# Altium schematic sheet Top Level.SchDoc
size A
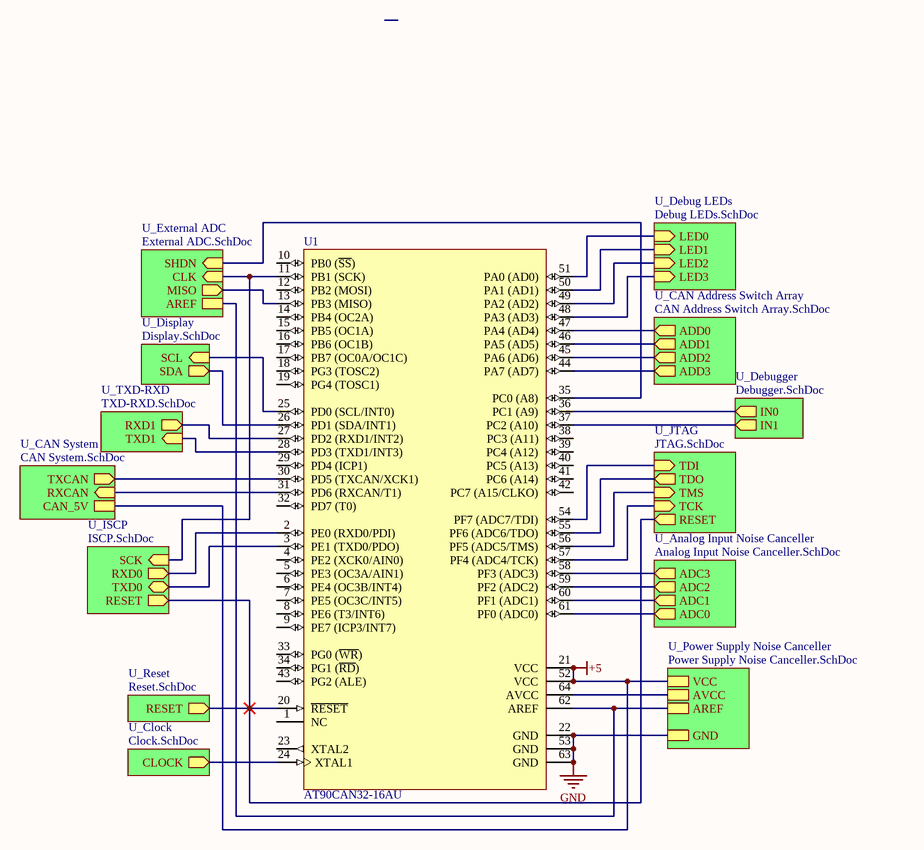
[diagram p0: Top Level.SchDoc]

## Parts
U1  AT90CAN32-16AU  [64A_N]

## Sub-sheets
U_Analog Input Noise Canceller = Analog Input Noise Canceller.SchDoc: ADC0 (out), ADC1 (out), ADC2 (out), ADC3 (out)
U_CAN Address Switch Array = CAN Address Switch Array.SchDoc: ADD0 (out), ADD1 (out), ADD2 (out), ADD3 (out)
U_CAN System = CAN System.SchDoc: RXCAN (in), CAN_5V, TXCAN (out)
U_Clock = Clock.SchDoc: CLOCK (out)
U_Debug LEDs = Debug LEDs.SchDoc: LED0 (in), LED1 (in), LED2 (in), LED3 (in)
U_Debugger = Debugger.SchDoc: IN0 (out), IN1 (out)
U_Display = Display.SchDoc: SCL (in), SDA (out)
U_External ADC = External ADC.SchDoc: AREF, CLK (in), SHDN (in), MISO (out)
U_ISCP = ISCP.SchDoc: SCK (in), TXD0 (bidir), RESET (out), RXD0 (out)
U_JTAG = JTAG.SchDoc: TDI (in), TDO (out), TCK (in), TMS (in), RESET (out)
U_Power Supply Noise Canceller = Power Supply Noise Canceller.SchDoc: VCC, AREF, GND, AVCC
U_Reset = Reset.SchDoc: RESET (out)
U_TXD-RXD = TXD-RXD.SchDoc: TXD1 (in), RXD1 (out)

## Nets
+5: U1.21(VCC) U1.52(VCC) ; sheet U_Power Supply Noise Canceller/VCC, sheet U_CAN System/CAN_5V
GND: U1.22(GND) U1.53(GND) U1.63(GND) ; sheet U_Power Supply Noise Canceller/GND
NetU1_2: U1.2(PE0_(RXD0/PDI)) ; sheet U_ISCP/RXD0
NetU1_3: U1.3(PE1_(TXD0/PDO)) ; sheet U_ISCP/TXD0
NetU1_11: U1.11(PB1_(SCK)) ; sheet U_ISCP/SCK, sheet U_External ADC/CLK
NetU1_13: U1.13(PB3_(MISO)) ; sheet U_External ADC/MISO
NetU1_20: U1.20(~{RESET}) ; sheet U_JTAG/RESET, sheet U_Reset/RESET, sheet U_ISCP/RESET
NetU1_24: U1.24(XTAL1) ; sheet U_Clock/CLOCK
NetU1_25: U1.25(PD0_(SCL/INT0)) ; sheet U_Display/SCL
NetU1_26: U1.26(PD1_(SDA/INT1)) ; sheet U_Display/SDA
NetU1_27: U1.27(PD2_(RXD1/INT2)) ; sheet U_TXD-RXD/RXD1
NetU1_28: U1.28(PD3_(TXD1/INT3)) ; sheet U_TXD-RXD/TXD1
NetU1_30: U1.30(PD5_(TXCAN/XCK1)) ; sheet U_CAN System/TXCAN
NetU1_31: U1.31(PD6_(RXCAN/T1)) ; sheet U_CAN System/RXCAN
NetU1_35: U1.35(PC0_(A8)) ; sheet U_External ADC/SHDN
NetU1_36: U1.36(PC1_(A9)) ; sheet U_Debugger/IN0
NetU1_37: U1.37(PC2_(A10)) ; sheet U_Debugger/IN1
NetU1_44: U1.44(PA7_(AD7)) ; sheet U_CAN Address Switch Array/ADD3
NetU1_45: U1.45(PA6_(AD6)) ; sheet U_CAN Address Switch Array/ADD2
NetU1_46: U1.46(PA5_(AD5)) ; sheet U_CAN Address Switch Array/ADD1
NetU1_47: U1.47(PA4_(AD4)) ; sheet U_CAN Address Switch Array/ADD0
NetU1_48: U1.48(PA3_(AD3)) ; sheet U_Debug LEDs/LED3
NetU1_49: U1.49(PA2_(AD2)) ; sheet U_Debug LEDs/LED2
NetU1_50: U1.50(PA1_(AD1)) ; sheet U_Debug LEDs/LED1
NetU1_51: U1.51(PA0_(AD0)) ; sheet U_Debug LEDs/LED0
NetU1_54: U1.54(PF7_(ADC7/TDI)) ; sheet U_JTAG/TDI
NetU1_55: U1.55(PF6_(ADC6/TDO)) ; sheet U_JTAG/TDO
NetU1_56: U1.56(PF5_(ADC5/TMS)) ; sheet U_JTAG/TMS
NetU1_57: U1.57(PF4_(ADC4/TCK)) ; sheet U_JTAG/TCK
NetU1_58: U1.58(PF3_(ADC3)) ; sheet U_Analog Input Noise Canceller/ADC3
NetU1_59: U1.59(PF2_(ADC2)) ; sheet U_Analog Input Noise Canceller/ADC2
NetU1_60: U1.60(PF1_(ADC1)) ; sheet U_Analog Input Noise Canceller/ADC1
NetU1_61: U1.61(PF0_(ADC0)) ; sheet U_Analog Input Noise Canceller/ADC0
NetU1_62: U1.62(AREF) ; sheet U_Power Supply Noise Canceller/AREF, sheet U_External ADC/AREF
NetU1_64: U1.64(AVCC) ; sheet U_Power Supply Noise Canceller/AVCC

Not connected (* = marked no-connect by the designer): U1 1(NC) 4(PE2_(XCK0/AIN0)) 5(PE3_(OC3A/AIN1)) 6(PE4_(OC3B/INT4)) 7(PE5_(OC3C/INT5)) 8(PE6_(T3/INT6)) 9(PE7_(ICP3/INT7)) 10(PB0_(~{SS})) 12(PB2_(MOSI)) 14(PB4_(OC2A)) 15(PB5_(OC1A)) 16(PB6_(OC1B)) 17(PB7_(OC0A/OC1C)) 18(PG3_(TOSC2)) 19(PG4_(TOSC1)) 23(XTAL2) 29(PD4_(ICP1)) 32(PD7_(T0)) 33(PG0_(~{WR})) 34(PG1_(~{RD})) 38(PC3_(A11)) 39(PC4_(A12)) 40(PC5_(A13)) 41(PC6_(A14)) 42(PC7_(A15/CLKO)) 43(PG2_(ALE))

## Library data of the parts
U1 = CMP-0096-00116-2: 8-bit AVR Microcontroller, 32KB Flash and CAN Controller, 53 GPIO pins, Industrial Grade (-40° to +85°C), 64-pin LQFP, Green; RevisionNote: PackageVersion updated. URLs added.; DatasheetVersion: revH, Aug-2008; PackageReference: 64A; ComponentLink3URL: http://www.atmel.com/dyn/resources/prod_documents/7679S.pdf; ComponentLink3Description: AT90CAN32/64/128 Summary; ComponentLink2Description: AT90CAN32/64/128 Datasheet; ComponentLink2URL: http://www.atmel.com/dyn/resources/prod_documents/doc7679.pdf; ComponentLink1URL: http://www.atmel.com/; PackageVersion: revC, Oct-2010; PackageDescription: 64-Pin Plastic Thin Profile Quad Flat Pack, 14 x 14 x 1.0 mm Body, 0.8 mm Pitch (TQFP); Code_JEDEC: MS-026-AEB; ComponentLink1Description: Manufacturer URL